# Altium project MB1936.PrjPcb (part 8 of 8)
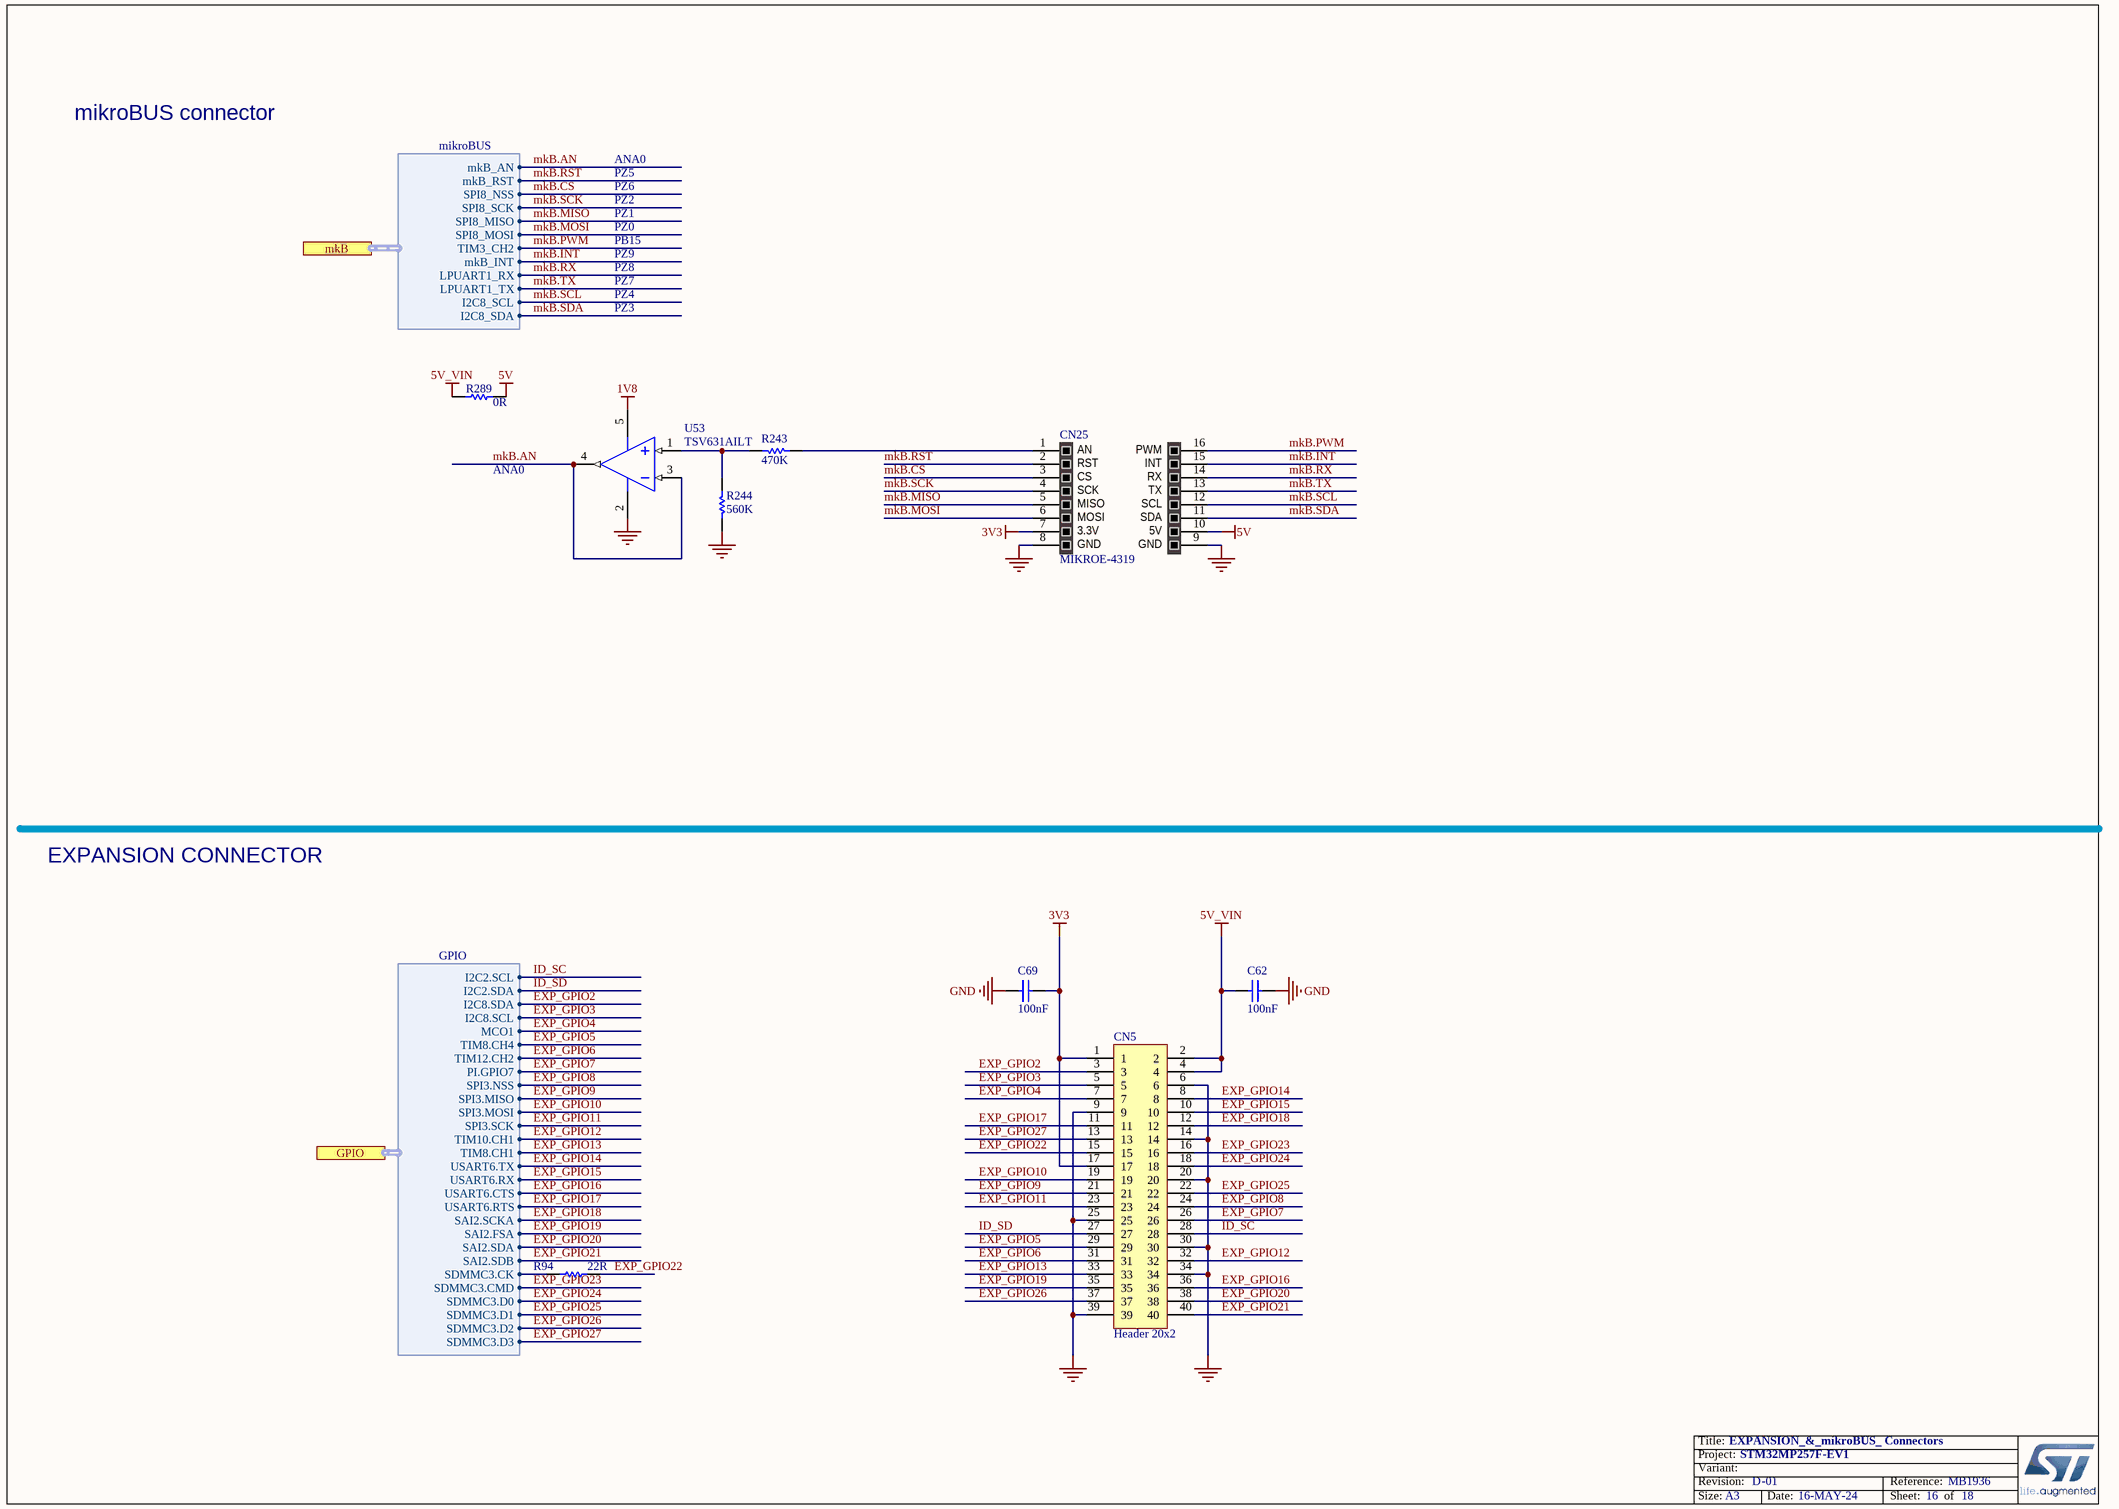
[diagram p18: Expansion _&_mikroBUS_Connectors.SchDoc]

## Nets that join several sheets
1V5_PCIE: USB_PCIe (6 pins), Power_PMIC (R69.2)
1V8: Video (C1.2 CN3.60), SDcard_eMMC (11 pins), Power_MPU (20 pins), Power_PMIC (LNK1.2 LNK3.2 R35.2), Expansion _&_mikroBUS_Connectors (U53.5)
3V3: Video (9 pins), MP257_18x18 (R224.2 R228.2), FDCAN (6 pins), Ethernet1 (L10.2 L14.2), Ethernet2 (L9.2 L15.2), Ethernet3 (L11.2 L13.2), Peripherals (R3.1 R4.1 R19.2 R20.2), QSPI_NOR (C175.2 R23.2 R33.2 U22.B4), USB_HUB (20 pins), USB_PCIe (15 pins), Power_PMIC (8 pins), Expansion _&_mikroBUS_Connectors (C69.1 CN5.1 CN5.17 CN25.7)
5V_STLK: STLINK_V3EC (7 pins), Power_PMIC (JP4.1)
5V_VIN: Video (R5.2 R18.1), FDCAN (C14.1 C100.1 U23.3 U31.3), USB_HUB (C143.2 C146.2 L12.1), USB_PCIe (C162.2 Q5.5 Q5.6), STLINK_V3EC (D2.1 R216.2), Power_PMIC (25 pins), Expansion _&_mikroBUS_Connectors (C62.2 CN5.2 CN5.4 R289.1)
GND: Video (64 pins), SDcard_eMMC (27 pins), MP257_18x18 (15 pins), FDCAN (20 pins), Ethernet1 (38 pins), Ethernet2 (38 pins), Ethernet3 (38 pins), Peripherals (19 pins), QSPI_NOR (C175.1 U22.B3), Power_MPU (107 pins), USB_HUB (42 pins), 2_DDR4_16bits (87 pins), USB_PCIe (65 pins), STLINK_V3EC (103 pins), Power_PMIC (84 pins), Expansion _&_mikroBUS_Connectors (14 pins)
VBAT: Peripherals (R30.2), Power_MPU (C87.2 D6.3 U27.P7)
VDD3V3_USB: Power_MPU (R286.1), Power_PMIC (C61.2 U26.13)
VDD_DDR: Power_MPU (16 pins), 2_DDR4_16bits (61 pins), Power_PMIC (5 pins)
VDD_EMMC: SDcard_eMMC (6 pins), Power_PMIC (C65.1 U26.16)
VDD_SDCARD: SDcard_eMMC (C6.2 CN1.4), Power_PMIC (C72.1 U26.4)
VDDA1V8_AON: MP257_18x18 (R70.1 U27.T7), Power_MPU (C234.2 U27.R7), Power_PMIC (R58.2)
VDDCORE: Power_MPU (20 pins), Power_PMIC (LNK2.2 LNK5.1 R36.2)
VDDCPU: Power_MPU (14 pins), Power_PMIC (LNK4.1 LNK6.1 R39.2)
VDDGPU: Power_MPU (12 pins), Power_PMIC (LNK7.2 LNK10.1 R45.2)
VDDIO: MP257_18x18 (10 pins), Peripherals (11 pins), Power_MPU (18 pins), USB_PCIe (R91.2 R223.2), STLINK_V3EC (LNK13.1), Power_PMIC (LNK11.2 LNK12.2 R53.2 U26.29)
VDDIO_SDCARD: SDcard_eMMC (7 pins), Power_MPU (C195.2 U27.G10), Power_PMIC (C63.1 U26.2)
VPP_DDR: 2_DDR4_16bits (8 pins), Power_PMIC (C74.1 U26.7)
VREF_DDR: 2_DDR4_16bits (C49.2 C78.2 U28.M1 U29.M1), Power_PMIC (R52.2)
VTT_DDR: 2_DDR4_16bits (38 pins), Power_PMIC (C40.2 U26.44)
BOOT0: MP257_18x18 (U27.R4), Peripherals (SW1.8)
BOOT1: MP257_18x18 (U27.R3), Peripherals (SW1.7)
BOOT2: MP257_18x18 (U27.T2), Peripherals (SW1.6)
BOOT3: MP257_18x18 (U27.T1), Peripherals (SW1.5)
BUTTON.TAMP: MP257_18x18 (U27.M6), Peripherals (6 pins)
BUTTON.User1: MP257_18x18 (U27.E14), Peripherals (C12.2 R29.1)
BUTTON.User2: MP257_18x18 (U27.L5), Peripherals (C11.2 R28.1)
CAM_ENABLE: Video (CN4.18 U16.1), MP257_18x18 (U27.G5)
CAM_RESET: Video (CN4.17 U15.1), MP257_18x18 (U27.L6)
DISP.BLCTRL: Video (CN2.37 CN3.53 U2.1), MP257_18x18 (U27.H5)
DISP.DSI_INT: Video (CN3.4), MP257_18x18 (U27.D13)
DISP.LED_EN: Video (CN2.36 U4.1), MP257_18x18 (U27.H4)
DISP.LVDS_INT: Video (CN2.2 U1.1), MP257_18x18 (U27.G2)
DISP.RESET: Video (CN3.57 R2.1 R9.2), MP257_18x18 (U27.G4)
DISP.TE: Video (CN3.49), MP257_18x18 (U27.K7)
eMMC.SDMMC2_CK: SDcard_eMMC (R49.1 U24.M6), MP257_18x18 (U27.A20)
eMMC.SDMMC2_CMD: SDcard_eMMC (R37.1 U24.M5), MP257_18x18 (U27.F17)
eMMC.SDMMC2_D0: SDcard_eMMC (R44.1 U24.A3), MP257_18x18 (U27.B19)
eMMC.SDMMC2_D1: SDcard_eMMC (U24.A4), MP257_18x18 (U27.E17)
eMMC.SDMMC2_D2: SDcard_eMMC (U24.A5), MP257_18x18 (U27.C18)
eMMC.SDMMC2_D3: SDcard_eMMC (U24.B2), MP257_18x18 (U27.C19)
eMMC.SDMMC2_D4: SDcard_eMMC (U24.B3), MP257_18x18 (U27.A19)
eMMC.SDMMC2_D5: SDcard_eMMC (U24.B4), MP257_18x18 (U27.D18)
eMMC.SDMMC2_D6: SDcard_eMMC (U24.B5), MP257_18x18 (U27.E16)
eMMC.SDMMC2_D7: SDcard_eMMC (U24.B6), MP257_18x18 (U27.D17)
ETH1.CLK: MP257_18x18 (U27.W10), Ethernet1 (R197.1), Ethernet3 (R198.1)
ETH1.CLK125: MP257_18x18 (U27.AB12), Ethernet1 (R93.1)
ETH1.GTX_CLK: MP257_18x18 (U27.AA12), Ethernet1 (R162.1)
ETH1.MDC: MP257_18x18 (U27.V12), Ethernet1 (R202.1 U39.13), Ethernet3 (R203.1 U40.13)
ETH1.MDINT: MP257_18x18 (U27.U12), Ethernet1 (R316.1 U39.31)
ETH1.MDIO: MP257_18x18 (U27.V10), Ethernet1 (R192.1 U39.14), Ethernet3 (R193.1 U40.14)
ETH1.NRST: MP257_18x18 (R206.1 U27.M1), Ethernet1 (U39.12), Ethernet3 (U40.12)
ETH1.RX_CLK: MP257_18x18 (U27.U10), Ethernet1 (R115.1 R141.1 R302.2)
ETH1.RX_CTL: MP257_18x18 (U27.W12), Ethernet1 (R116.1 R142.1 R301.2)
ETH1.RXD0: MP257_18x18 (U27.W11), Ethernet1 (R117.1 R143.1 R296.2)
ETH1.RXD1: MP257_18x18 (U27.Y11), Ethernet1 (R108.1 R144.1 R295.2)
ETH1.RXD2: MP257_18x18 (U27.AA11), Ethernet1 (R145.1 R294.2)
ETH1.RXD3: MP257_18x18 (U27.AB11), Ethernet1 (R118.1 R146.1 R300.2)
ETH1.TX_CTL: MP257_18x18 (U27.Y12), Ethernet1 (R165.1)
ETH1.TXD0: MP257_18x18 (U27.T10), Ethernet1 (R168.1)
ETH1.TXD1: MP257_18x18 (U27.V11), Ethernet1 (R174.1)
ETH1.TXD2: MP257_18x18 (U27.U11), Ethernet1 (R179.1)
ETH1.TXD3: MP257_18x18 (U27.T11), Ethernet1 (R186.1)
ETH2.CLK: MP257_18x18 (U27.Y10), Ethernet2 (R196.1)
ETH2.CLK125: MP257_18x18 (U27.AA8), Ethernet2 (R176.1)
ETH2.GTX_CLK: MP257_18x18 (U27.T9), Ethernet2 (R161.1)
ETH2.MDC: MP257_18x18 (U27.AA10), Ethernet2 (R195.1 U38.13)
ETH2.MDINT: MP257_18x18 (U27.Y9), Ethernet2 (R318.1 U38.31)
ETH2.MDIO: MP257_18x18 (U27.U9), Ethernet2 (R191.1 U38.14)
ETH2.NRST: MP257_18x18 (R205.1 U27.H2), Ethernet2 (U38.12)
ETH2.RX_CLK: MP257_18x18 (U27.AB8), Ethernet2 (R109.1 R135.1 R305.2)
ETH2.RX_CTL: MP257_18x18 (U27.W9), Ethernet2 (R110.1 R136.1 R304.2)
ETH2.RXD0: MP257_18x18 (U27.W7), Ethernet2 (R111.1 R137.1 R293.2)
ETH2.RXD1: MP257_18x18 (U27.Y7), Ethernet2 (R112.1 R138.1 R292.2)
ETH2.RXD2: MP257_18x18 (U27.AA7), Ethernet2 (R113.2 R139.1)
ETH2.RXD3: MP257_18x18 (U27.AB7), Ethernet2 (R114.1 R140.1 R303.2)
ETH2.TX_CTL: MP257_18x18 (U27.V9), Ethernet2 (R164.1)
ETH2.TXD0: MP257_18x18 (U27.Y8), Ethernet2 (R167.1)
ETH2.TXD1: MP257_18x18 (U27.V8), Ethernet2 (R173.1)
ETH2.TXD2: MP257_18x18 (U27.U8), Ethernet2 (R178.1)
ETH2.TXD3: MP257_18x18 (U27.T8), Ethernet2 (R185.1)
ETH3.GTX_CLK: MP257_18x18 (U27.V13), Ethernet3 (R163.1)
ETH3.MDINT: MP257_18x18 (U27.V15), Ethernet3 (R314.1 U40.31)
ETH3.RX_CLK: MP257_18x18 (U27.Y13), Ethernet3 (R119.1 R147.1 R299.2)
ETH3.RX_CTL: MP257_18x18 (U27.W13), Ethernet3 (R120.1 R148.1 R298.2)
ETH3.RXD0: MP257_18x18 (U27.T12), Ethernet3 (R121.1 R149.1 R307.2)
ETH3.RXD1: MP257_18x18 (U27.U13), Ethernet3 (R122.1 R150.1 R306.2)
ETH3.RXD2: MP257_18x18 (U27.T13), Ethernet3 (R123.2 R151.1)
ETH3.RXD3: MP257_18x18 (U27.U14), Ethernet3 (R124.1 R152.1 R297.2)
ETH3.TX_CTL: MP257_18x18 (U27.T14), Ethernet3 (R166.1)
ETH3.TXD0: MP257_18x18 (U27.V14), Ethernet3 (R169.1)
ETH3.TXD1: MP257_18x18 (U27.Y14), Ethernet3 (R175.1)
ETH3.TXD2: MP257_18x18 (U27.AA14), Ethernet3 (R180.1)
ETH3.TXD3: MP257_18x18 (U27.W14), Ethernet3 (R187.1)
EXP_GPIO2: MP257_18x18 (R246.1 U27.N4), USB_PCIe (R291.2), Expansion _&_mikroBUS_Connectors (CN5.3 CN25.11)
EXP_GPIO3: MP257_18x18 (R245.1 U27.R5), USB_PCIe (R290.2), Expansion _&_mikroBUS_Connectors (CN5.5 CN25.12)
EXP_GPIO4: MP257_18x18 (TP11.1 U27.Y6), Expansion _&_mikroBUS_Connectors (CN5.7)
EXP_GPIO5: MP257_18x18 (U27.W3), Expansion _&_mikroBUS_Connectors (CN5.29)
EXP_GPIO6: MP257_18x18 (U27.B12), Expansion _&_mikroBUS_Connectors (CN5.31)
EXP_GPIO7: MP257_18x18 (U27.Y3), Expansion _&_mikroBUS_Connectors (CN5.26)
EXP_GPIO8: MP257_18x18 (U27.D11), Expansion _&_mikroBUS_Connectors (CN5.24)
EXP_GPIO9: MP257_18x18 (U27.A11), Expansion _&_mikroBUS_Connectors (CN5.21)
EXP_GPIO10: MP257_18x18 (U27.G11), Expansion _&_mikroBUS_Connectors (CN5.19)
EXP_GPIO11: MP257_18x18 (U27.D12), Expansion _&_mikroBUS_Connectors (CN5.23)
EXP_GPIO12: MP257_18x18 (U27.A12), Expansion _&_mikroBUS_Connectors (CN5.32)
EXP_GPIO13: MP257_18x18 (U27.V4), Expansion _&_mikroBUS_Connectors (CN5.33)
EXP_GPIO14: MP257_18x18 (U27.L4), Expansion _&_mikroBUS_Connectors (CN5.8)
EXP_GPIO15: MP257_18x18 (U27.H1), Expansion _&_mikroBUS_Connectors (CN5.10)
EXP_GPIO16: MP257_18x18 (U27.L7), Expansion _&_mikroBUS_Connectors (CN5.36)
EXP_GPIO17: MP257_18x18 (U27.L1), Expansion _&_mikroBUS_Connectors (CN5.11)
EXP_GPIO18: MP257_18x18 (U27.M5), Expansion _&_mikroBUS_Connectors (CN5.12)
EXP_GPIO19: MP257_18x18 (U27.AA3), Expansion _&_mikroBUS_Connectors (CN5.35)
EXP_GPIO20: MP257_18x18 (U27.L2), Expansion _&_mikroBUS_Connectors (CN5.38)
EXP_GPIO21: MP257_18x18 (U27.AB3), Expansion _&_mikroBUS_Connectors (CN5.40)
EXP_GPIO23: MP257_18x18 (U27.A21), Expansion _&_mikroBUS_Connectors (CN5.16)
EXP_GPIO24: MP257_18x18 (U27.C20), Expansion _&_mikroBUS_Connectors (CN5.18)
EXP_GPIO25: MP257_18x18 (U27.B21), Expansion _&_mikroBUS_Connectors (CN5.22)
EXP_GPIO26: MP257_18x18 (U27.B20), Expansion _&_mikroBUS_Connectors (CN5.37)
EXP_GPIO27: MP257_18x18 (U27.E18), Expansion _&_mikroBUS_Connectors (CN5.13)
FDCAN1.RX: MP257_18x18 (U27.J3), FDCAN (U23.4)
FDCAN1.STBY: MP257_18x18 (U27.M4), FDCAN (R34.1 U23.8)
FDCAN1.TX: MP257_18x18 (U27.J4), FDCAN (U23.1)
FDCAN3.RX: MP257_18x18 (U27.G1), FDCAN (U31.4)
FDCAN3.STBY: MP257_18x18 (U27.K2), FDCAN (R81.1 U31.8)
FDCAN3.TX: MP257_18x18 (U27.L3), FDCAN (U31.1)
GPIO.SDMMC3_CK: MP257_18x18 (U27.D19), Expansion _&_mikroBUS_Connectors (R94.1)
HDMI_CEC: Video (CN3.47), MP257_18x18 (U27.F12)
HDMI_I2S2.CK: Video (CN3.35), MP257_18x18 (U27.C11)
HDMI_I2S2.WS: Video (CN3.37), MP257_18x18 (U27.G13)
HDMI_I2S2_SDO: Video (CN3.39), MP257_18x18 (U27.E12)
I2C1.SCL: MP257_18x18 (R224.1 U27.K5), USB_PCIe (U50.18)
I2C1.SDA: MP257_18x18 (R228.1 U27.H6), USB_PCIe (U50.17)
I2C2.SCL: Video (CN2.7 CN3.44 CN4.20), MP257_18x18 (R32.1 U27.B11), Expansion _&_mikroBUS_Connectors (CN5.28)
I2C2.SDA: Video (CN2.8 CN3.40 CN4.21), MP257_18x18 (R31.1 U27.D10), Expansion _&_mikroBUS_Connectors (CN5.27)
I2C7.SCL: MP257_18x18 (R261.1 U27.F16), Power_PMIC (U26.33)
I2C7.SDA: MP257_18x18 (R260.1 U27.G15), Power_PMIC (U26.34)
IMU_INT1: Video (CN4.14 U13.1), MP257_18x18 (U27.J6)
IMU_INT2: Video (CN4.15 U14.1), MP257_18x18 (U27.K6)
JTCK_SWCLK: MP257_18x18 (CN22.4 CN22.7 U27.AA1), STLINK_V3EC (R153.2)
JTDI: MP257_18x18 (CN22.8 U27.AB2), STLINK_V3EC (R207.2)
JTDO_SWDO: MP257_18x18 (CN22.6 U27.W1), STLINK_V3EC (R129.2)
JTMS_SWDIO: MP257_18x18 (CN22.2 U27.Y1), STLINK_V3EC (R209.2)
LED1: MP257_18x18 (U27.AB15), Peripherals (LD1.2)
LED2: MP257_18x18 (U27.C13), Peripherals (Q3.1 R17.2)
LED3: MP257_18x18 (U27.U5), Peripherals (Q2.1 R16.2)
LED4: MP257_18x18 (U27.W2), Peripherals (Q1.1 R8.2)
mkB.AN: MP257_18x18 (U27.V5), Expansion _&_mikroBUS_Connectors (U53.3 U53.4)
mkB.CS: MP257_18x18 (U27.R6), Expansion _&_mikroBUS_Connectors (CN25.3)
mkB.INT: MP257_18x18 (U27.N3), Expansion _&_mikroBUS_Connectors (CN25.15)
mkB.MISO: MP257_18x18 (U27.N6), Expansion _&_mikroBUS_Connectors (CN25.5)
mkB.MOSI: MP257_18x18 (U27.N5), Expansion _&_mikroBUS_Connectors (CN25.6)
mkB.PWM: MP257_18x18 (U27.AB4), Expansion _&_mikroBUS_Connectors (CN25.16)
mkB.RST: MP257_18x18 (U27.P5), Expansion _&_mikroBUS_Connectors (CN25.2)
mkB.RX: MP257_18x18 (U27.P3), Expansion _&_mikroBUS_Connectors (CN25.14)
mkB.SCK: MP257_18x18 (U27.P4), Expansion _&_mikroBUS_Connectors (CN25.4)
mkB.TX: MP257_18x18 (U27.P2), Expansion _&_mikroBUS_Connectors (CN25.13)
NRST: MP257_18x18 (C336.2 CN22.10 U27.U3), Peripherals (B1.1 B1.2 R7.1 U10.1), QSPI_NOR (R21.1), STLINK_V3EC (R212.2), Power_PMIC (R38.1)
NRSTC1MS: SDcard_eMMC (D5.2), MP257_18x18 (R27.1 R272.1 U27.T3), QSPI_NOR (R22.1), Power_PMIC (R59.1)
PA0_WKUP: MP257_18x18 (U27.Y2), Power_PMIC (U26.32)
PCIE.CLKREQN: MP257_18x18 (U27.U15), USB_PCIe (CN13.7 Q4.1 R91.1)
PCIE.NWAKE: MP257_18x18 (U27.AA15), USB_PCIe (CN13.1)
PCIE.RSTN: MP257_18x18 (R96.1 U27.M2), USB_PCIe (CN13.22)
PCIE.USB_N: USB_HUB (U34.1), USB_PCIe (CN13.36)
PCIE.USB_P: USB_HUB (U34.2), USB_PCIe (CN13.38)
PWR_CPU_ON: MP257_18x18 (R272.2 U27.T6), Power_PMIC (R60.1)
PWR_ON: MP257_18x18 (R74.2 U27.T5), Power_PMIC (R61.1)
QSPI1.CLK: MP257_18x18 (U27.D14), QSPI_NOR (U22.B2)
QSPI1.IO0: MP257_18x18 (U27.C14), QSPI_NOR (U22.D3)
QSPI1.IO1: MP257_18x18 (U27.B15), QSPI_NOR (U22.D2)
QSPI1.IO2: MP257_18x18 (U27.A15), QSPI_NOR (U22.C4)
QSPI1.IO3: MP257_18x18 (U27.D15), QSPI_NOR (U22.D4)
QSPI1.NCS1: MP257_18x18 (U27.C15), QSPI_NOR (R33.1 U22.C2)
SD.SDMMC1_CK: SDcard_eMMC (R247.1), MP257_18x18 (U27.D16)
SD.SDMMC1_CMD: SDcard_eMMC (CN1.3 R12.1 U8.4 U8.7), MP257_18x18 (U27.C16)
SD.SDMMC1_D0: SDcard_eMMC (CN1.7 R14.1 U9.2 U9.9), MP257_18x18 (U27.B17)
SD.SDMMC1_D1: SDcard_eMMC (CN1.8 R15.1 U9.4 U9.7), MP257_18x18 (U27.C17)
SD.SDMMC1_D2: SDcard_eMMC (CN1.1 R10.1 U8.1 U8.10), MP257_18x18 (U27.A16)
SD.SDMMC1_D3: SDcard_eMMC (CN1.2 R11.1 U8.2 U8.9), MP257_18x18 (U27.B16)
SD.uSD_DETECT: SDcard_eMMC (R6.1), MP257_18x18 (U27.B13)
TCPP_EN: MP257_18x18 (U27.Y4), USB_PCIe (R326.1)
TCPP_INTN: MP257_18x18 (U27.W6), USB_PCIe (U50.19)
TOF_INT: Video (CN4.12 U12.1), MP257_18x18 (U27.J5)
TOF_LPn: Video (CN4.11 U11.1), MP257_18x18 (U27.K4)
USBH_N: USB_HUB (U34.30), USB_PCIe (U27.AB16)
USBH_P: USB_HUB (U34.31), USB_PCIe (U27.AA16)
VBUS_DIV: MP257_18x18 (TP35.1 U27.AA6), USB_PCIe (R219.1 R220.2)
WAKEUPn: MP257_18x18 (U27.P6), Power_PMIC (R46.1)

## Assembly variants
MP257F_X: not fitted C91 C151 C165 C166 CN14 D5 R22 R27 R30 R56 R70 R72 R74 R77 R78 R93 R97 R99 R100 R108 R109 R110 R111 R112 R115 R117 R118 R119 R121 R122 R196 R197 R198 R223 R227 R229 R288 R290 R291 R297 R298 R301 R303 R325 R328 U49